# EAGLE design IronDriverRevA (EAGLE 6.2)

## Sheet 1 of 3
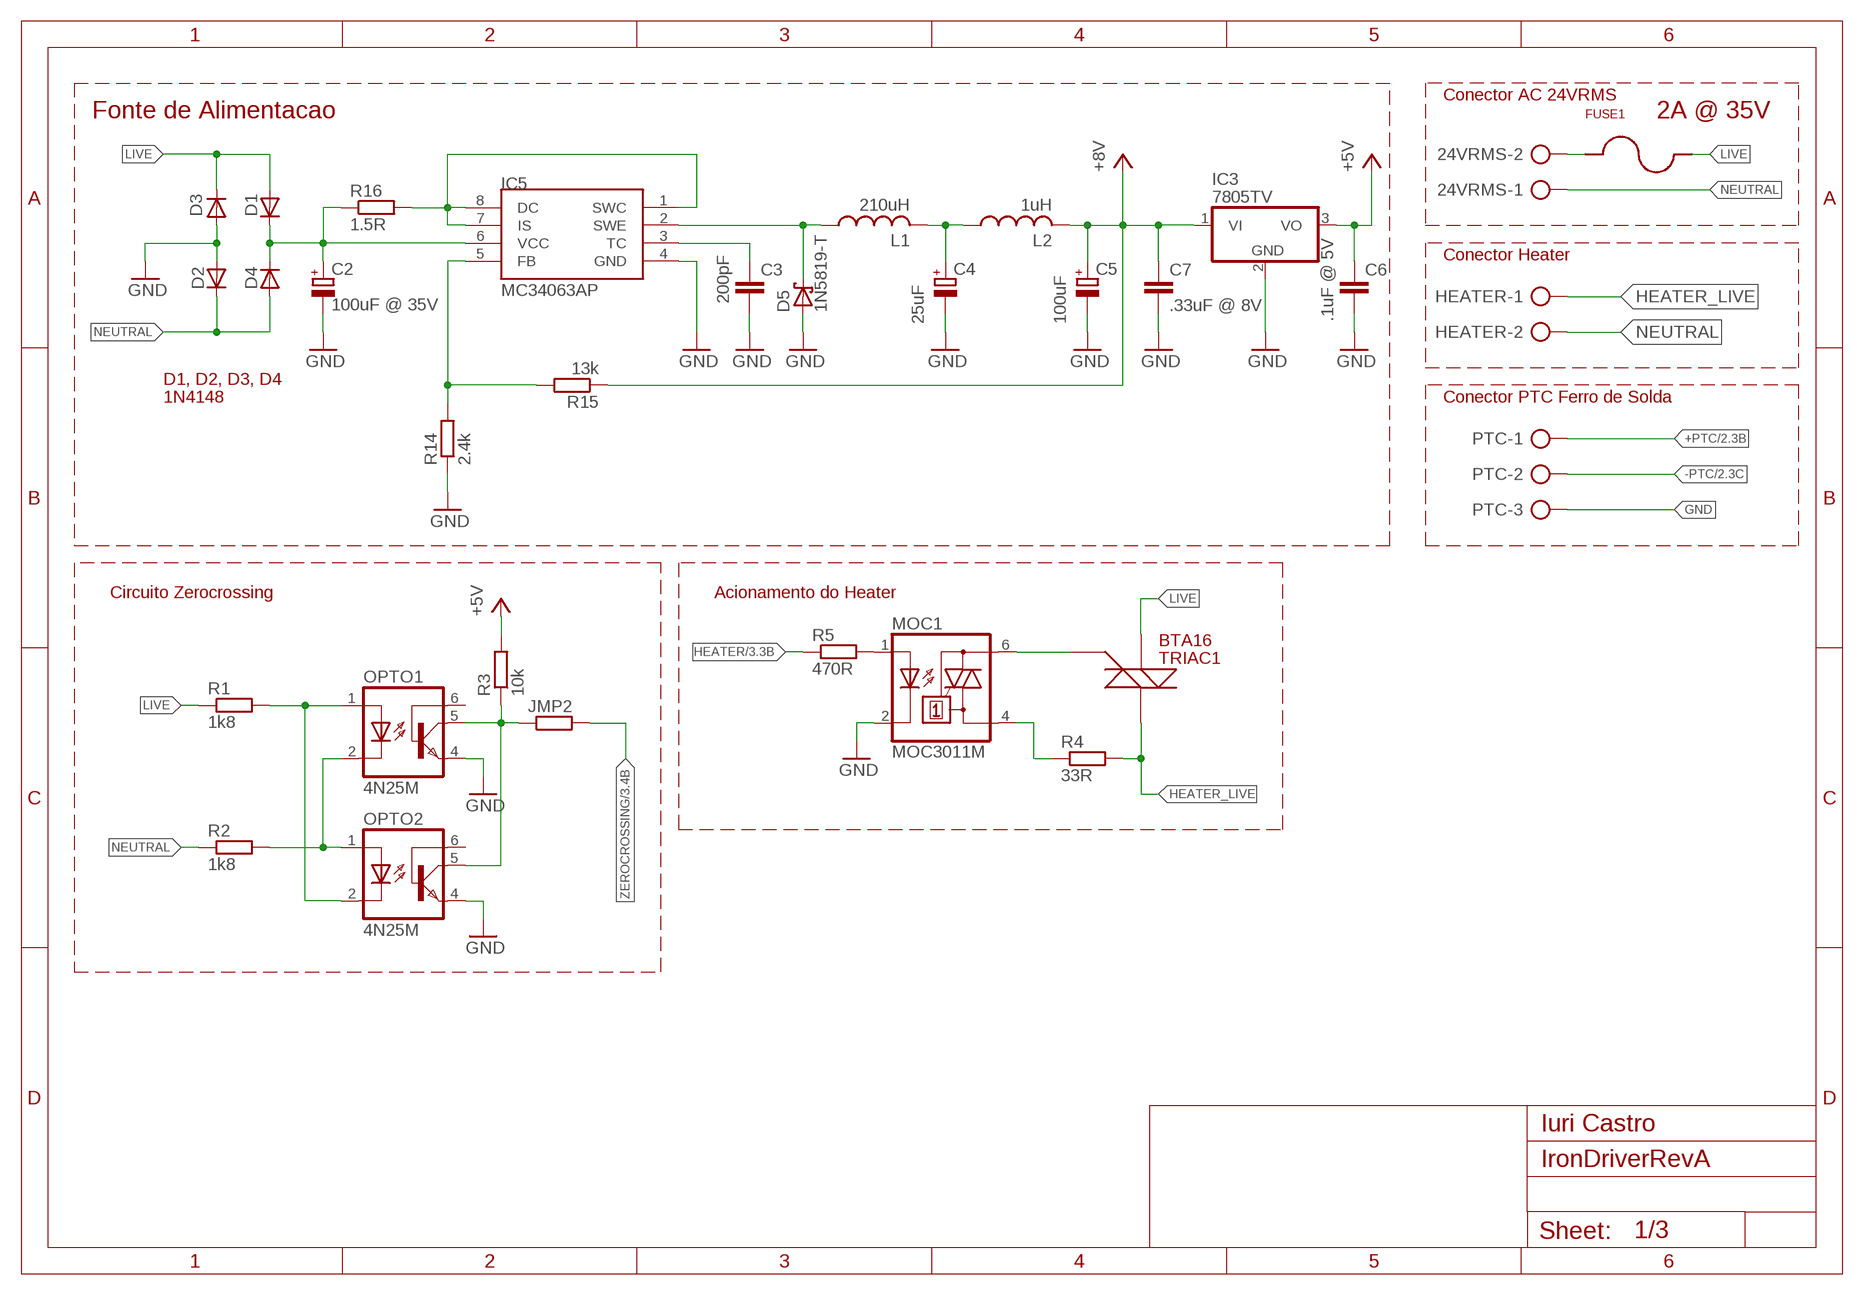
[diagram p0: schematic, sheet 1]

### Parts
24VRMS  AK500/2  [AK500/2]
C2  100uF @ 35V  CPOL-EUE3.5-8  [E3,5-8]
C3  200pF  C-EU025-025X050  [C025-025X050]
C4  25uF  CPOL-EUE3.5-8  [E3,5-8]
C5  100uF  CPOL-EUE3.5-8  [E3,5-8]
C6  .1uF @ 5V  C-EU025-025X050  [C025-025X050]
C7  .33uF @ 8V  C-EU025-025X050  [C025-025X050]
D1  1N4004  [DO41-10]
D2  1N4004  [DO41-10]
D3  1N4004  [DO41-10]
D4  1N4004  [DO41-10]
D5  1N5819-T  [DO41-7.6]
FUSE1  FUSEHOLDER  [FUSE32V2A5]
HEATER  AK500/2  [AK500/2]
IC3  7805TV  [TO220V]
IC5  MC34063AP  [DIL08]
JMP2  R-EU_R1206  [R1206]
L1  210uH  L-US6000-XXX-RC  [6000-XXXX-RC]
L2  1uH  L-US0204/7  [0204/7]
MOC1  MOC3011M  [DIL06]
OPTO1  4N25M  [DIL06]
OPTO2  4N25M  [DIL06]
PTC  AK500/3  [AK500/3]
R1  1k8  R-EU_0207/7  [0207/7]
R2  1k8  R-EU_0207/7  [0207/7]
R3  10k  R-EU_0207/7  [0207/7]
R4  33R  R-EU_0207/7  [0207/7]
R5  470R  R-EU_0207/7  [0207/7]
R14  2.4k  R-EU_0207/7  [0207/7]
R15  13k  R-EU_0207/7  [0207/7]
R16  1.5R  R-EU_0207/7  [0207/7]
TRIAC1  BTA16  BTA16-600BRG  [TO220V]

### Nets
+5V: C6.1 IC3.3(VO) R3.2 ; also sheet 3
+8V: C5.+ C7.1 IC3.1(VI) L2.2 R15.1 ; also sheet 2
+PTC: PTC.1 ; also sheet 2
-PTC: PTC.2 ; also sheet 2
GND: C2.- C3.2 C4.- C5.- C6.2 C7.2 D2.A D3.A D5.A IC3.2(GND) IC5.4(GND) MOC1.2(C) OPTO1.4(EMI) OPTO2.4(EMI) PTC.3 R14.1 ; also sheet 2,3
HEATER: R5.1 ; also sheet 3
HEATER_LIVE: HEATER.1 R4.2 TRIAC1.2(A2)
LIVE: D1.A D3.C FUSE1.P$3 FUSE1.P$4 R1.1 TRIAC1.1(A1)
N$1: MOC1.1(A) R5.2
N$3: OPTO1.2(C) OPTO2.1(A) R2.2
N$4: OPTO1.1(A) OPTO2.2(C) R1.2
N$8: MOC1.6(A2) TRIAC1.3(G)
N$10: MOC1.4(A1) R4.1
N$11: 24VRMS.2 FUSE1.P$1 FUSE1.P$2
N$13: D5.C IC5.2(SWE) L1.1
N$14: IC5.5(FB) R14.2 R15.2
N$15: IC5.1(SWC) IC5.7(IS) IC5.8(DC) R16.2
N$16: C4.+ L1.2 L2.1
N$18: C3.1 IC5.3(TC)
N$20: C2.+ D1.C D4.C IC5.6(VCC) R16.1
NEUTRAL: 24VRMS.1 D2.C D4.A HEATER.2 R2.1
ZEROCROSSING: JMP2.2 ; also sheet 3
ZEROCROSSING_B: JMP2.1 OPTO1.5(COL) OPTO2.5(COL) R3.1
Unconnected: OPTO1.6(BAS) OPTO2.6(BAS)

### Notes on the sheet
- Conector AC 24VRMS
- Fonte de Alimentacao | 2A @ 35V
- Conector Heater
- D1, D2, D3, D4
- 1N4148 | Conector PTC Ferro de Solda
- Circuito Zerocrossing | Acionamento do Heater
- Iuri Castro

## Sheet 2 of 3
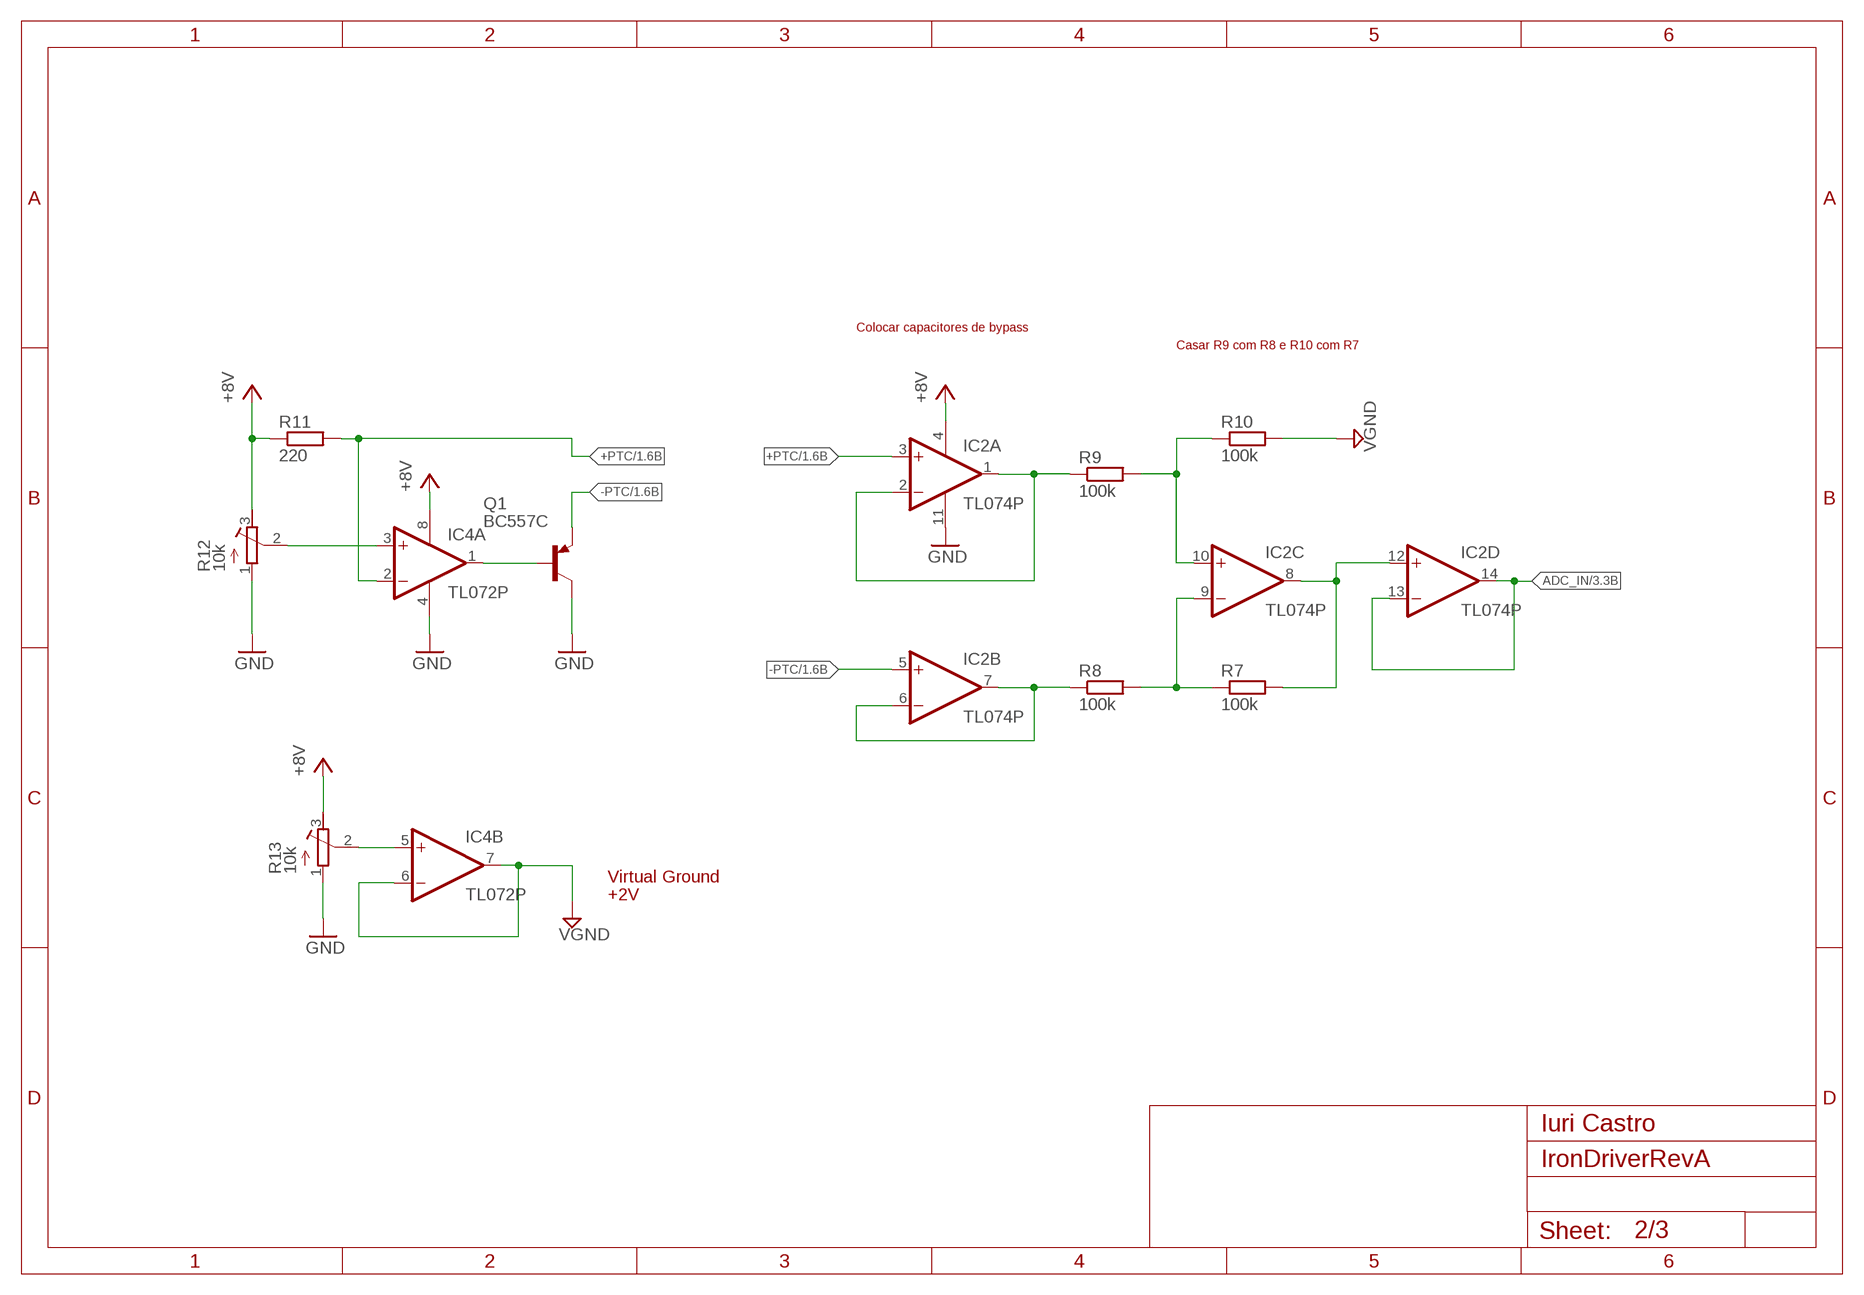
[diagram p1: schematic, sheet 2]

### Parts
IC2  TL074P  [DIL14]
IC4  TL072P  [DIL08]
Q1  BC557C  [TO92-EBC]
R7  100k  R-EU_0207/7  [0207/7]
R8  100k  R-EU_0207/7  [0207/7]
R9  100k  R-EU_0207/7  [0207/7]
R10  100k  R-EU_0207/7  [0207/7]
R11  220  R-EU_0207/7  [0207/7]
R12  10k  R-TRIMM3296W  [RTRIM3296W]
R13  10k  R-TRIMM3296W  [RTRIM3296W]

### Nets
+8V: IC2.4(P:V+) IC4.8(P:V+) R11.1 R12.3(E) R13.3(E) ; also sheet 1
+PTC: IC2.3(A:+IN) IC4.2(A:-IN) R11.2 ; also sheet 1
-PTC: IC2.5(B:+IN) Q1.E ; also sheet 1
ADC_IN: IC2.13(D:-IN) IC2.14(D:OUT) ; also sheet 3
GND: IC2.11(P:V-) IC4.4(P:V-) Q1.C R12.1(A) R13.1(A) ; also sheet 1,3
N$2: IC4.1(A:OUT) Q1.B
N$5: IC2.9(C:-IN) R7.1 R8.2
N$6: IC2.10(C:+IN) R9.2 R10.1
N$7: IC4.5(B:+IN) R13.2(S)
N$9: IC2.1(A:OUT) IC2.2(A:-IN) R9.1
N$12: IC2.6(B:-IN) IC2.7(B:OUT) R8.1
N$19: IC2.8(C:OUT) IC2.12(D:+IN) R7.2
N$21: IC4.3(A:+IN) R12.2(S)
VGND: IC4.6(B:-IN) IC4.7(B:OUT) R10.2 ; also sheet 3

### Notes on the sheet
- Colocar capacitores de bypass
- Casar R9 com R8 e R10 com R7
- Virtual Ground
- +2V
- Iuri Castro

## Sheet 3 of 3
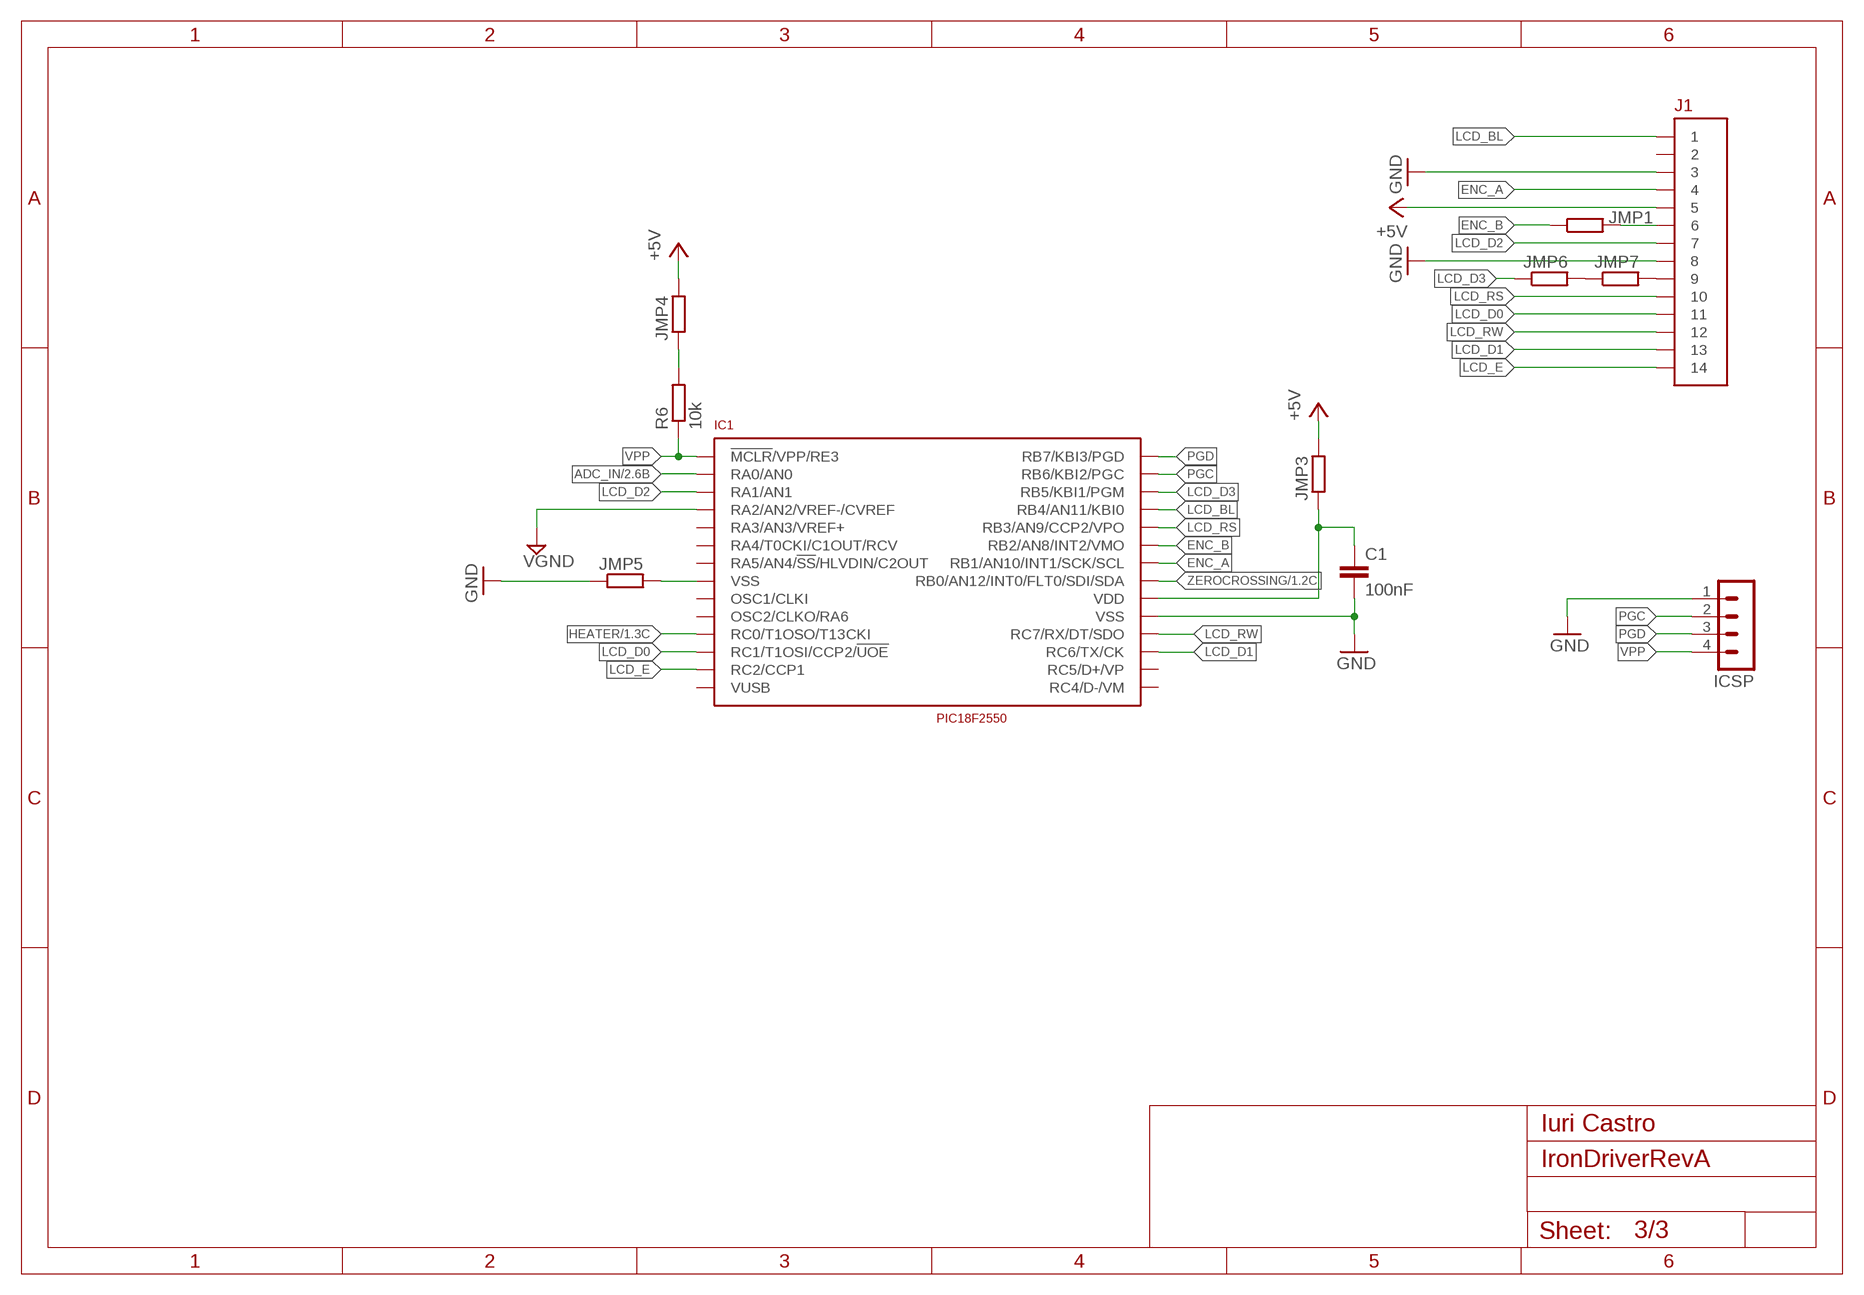
[diagram p2: schematic, sheet 3]

### Parts
C1  100nF  C-EUC0805  [C0805]
IC1  PIC18F2550  [DIL28-3]
ICSP  MA04-1  [MA04-1]
J1  FFC14X1  [FFC14X1]
JMP1  R-EU_R1206  [R1206]
JMP3  R-EU_R1206  [R1206]
JMP4  R-EU_R1206  [R1206]
JMP5  R-EU_R1206  [R1206]
JMP6  R-EU_R1206  [R1206]
JMP7  R-EU_R1206  [R1206]
R6  10k  R-EU_0207/7  [0207/7]

### Nets
+5V: JMP3.2 JMP4.2 ; also sheet 1
+5V_JMP4: J1.P$5 JMP4.1 R6.2 ; supply symbol labelled +5V
+5V_MC: C1.1 IC1.20(VDD) JMP3.1
ADC_IN: IC1.2(RA0/AN0) ; also sheet 2
ENC_A: IC1.22(RB1/AN10/INT1/SCK/SCL) J1.P$4
ENC_B: IC1.23(RB2/AN8/INT2/VMO) JMP1.1
GND: C1.2 IC1.8(VSS) IC1.19(VSS) ICSP.1 J1.P$8 JMP5.2 ; also sheet 1,2
GND_JMP5: J1.P$3 JMP5.1 ; supply symbol labelled GND
HEATER: IC1.11(RC0/T1OSO/T13CKI) ; also sheet 1
LCD_BL: IC1.25(RB4/AN11/KBI0) J1.P$1
LCD_D0: IC1.12(RC1/T1OSI/CCP2/!UOE) J1.P$11
LCD_D1: IC1.17(RC6/TX/CK) J1.P$13
LCD_D2: IC1.3(RA1/AN1) J1.P$7
LCD_D3: IC1.26(RB5/KBI1/PGM) JMP6.1
LCD_E: IC1.13(RC2/CCP1) J1.P$14
LCD_RS: IC1.24(RB3/AN9/CCP2/VPO) J1.P$10
LCD_RW: IC1.18(RC7/RX/DT/SDO) J1.P$12
N$17: J1.P$6 JMP1.2
N$23: J1.P$9 JMP7.2
N$24: JMP6.2 JMP7.1
PGC: IC1.27(RB6/KBI2/PGC) ICSP.2
PGD: IC1.28(RB7/KBI3/PGD) ICSP.3
VGND: IC1.4(RA2/AN2/VREF-/CVREF) ; also sheet 2
VPP: IC1.1(!MCLR!/VPP/RE3) ICSP.4 R6.1
ZEROCROSSING: IC1.21(RB0/AN12/INT0/FLT0/SDI/SDA) ; also sheet 1
Unconnected: IC1.5(RA3/AN3/VREF+) IC1.6(RA4/T0CKI/C1OUT/RCV) IC1.7(RA5/AN4/!SS!/HLVDIN/C2OUT) IC1.9(OSC1/CLKI) IC1.10(OSC2/CLKO/RA6) IC1.14(VUSB) IC1.15(RC4/D-/VM) IC1.16(RC5/D+/VP) J1.P$2

### Notes on the sheet
- Iuri Castro

## Library data of the parts
24VRMS HEATER = con-ptr500:AK500/2: CONNECTOR; OC_FARNELL: unknown; OC_NEWARK: unknown
C1 C3 C6 C7 = rcl:C-EU: CAPACITOR, European symbol
C2 C4 C5 = rcl:CPOL-EU: POLARIZED CAPACITOR, European symbol
D1-D4 = diode:1N4004: DIODE general purpose rectifier, 1 A
D5 = diode:1N581*: 1.0A SCHOTTKY BARRIER RECTIFIER Source: http://www.diodes.com/datasheets/ds23001.pdf
FUSE1 = FUSEHOLDER:FUSEHOLDER: Fuse Holder
IC1 = PIC18F2550:PIC18F2550: PIC18F2550 Dip
IC2 = linear:TL074: OP AMP
IC3 = linear:78*: Positive VOLTAGE REGULATOR Source: http://cache.national.com/ds/LM/LM78L05.pdf http://www.fairchildsemi.com/ds/LM/LM7805.pdf
IC4 = linear:TL072: OP AMP
IC5 = mc34063:MC34063
ICSP = con-lstb:MA04-1: PIN HEADER; OC_FARNELL: unknown; OC_NEWARK: unknown
J1 = FFC:FFC14X1: Conector FFC 14
JMP1-JMP7 R1-R11 R14-R16 = rcl:R-EU_: RESISTOR, European symbol
L1 L2 = rcl:L-US: INDUCTOR, American symbol
MOC1 = optocoupler:MOC30*M: RANDOM-PHASE OPTOISOLATORS TRIAC DRIVER OUTPUT Source: http://www.fairchildsemi.com MOC3020-M.pdf; MF: FAIRCHILD SEMICONDUCTOR; MPN: MOC3011-M; OC_FARNELL: 1021363; OC_NEWARK: 72K8893
OPTO1 OPTO2 = optocoupler:4N*?M: General Purpose 6-Pin Phototransistor Optocouplers Source: http://www.fairchildsemi.com/ds/4N/4N35-M.pdf; MPN: 4N25-M; OC_FARNELL: 1021349; OC_NEWARK: 98K9084
PTC = con-ptr500:AK500/3: CONNECTOR; OC_FARNELL: unknown; OC_NEWARK: unknown
Q1 = transistor-pnp:BC557*: PNP Transistror
R12 R13 = rcl:R-TRIMM: Trimm resistor
TRIAC1 = BTA16-600BRG:BTA16-600BRG: BTA16-600BRG

## Board
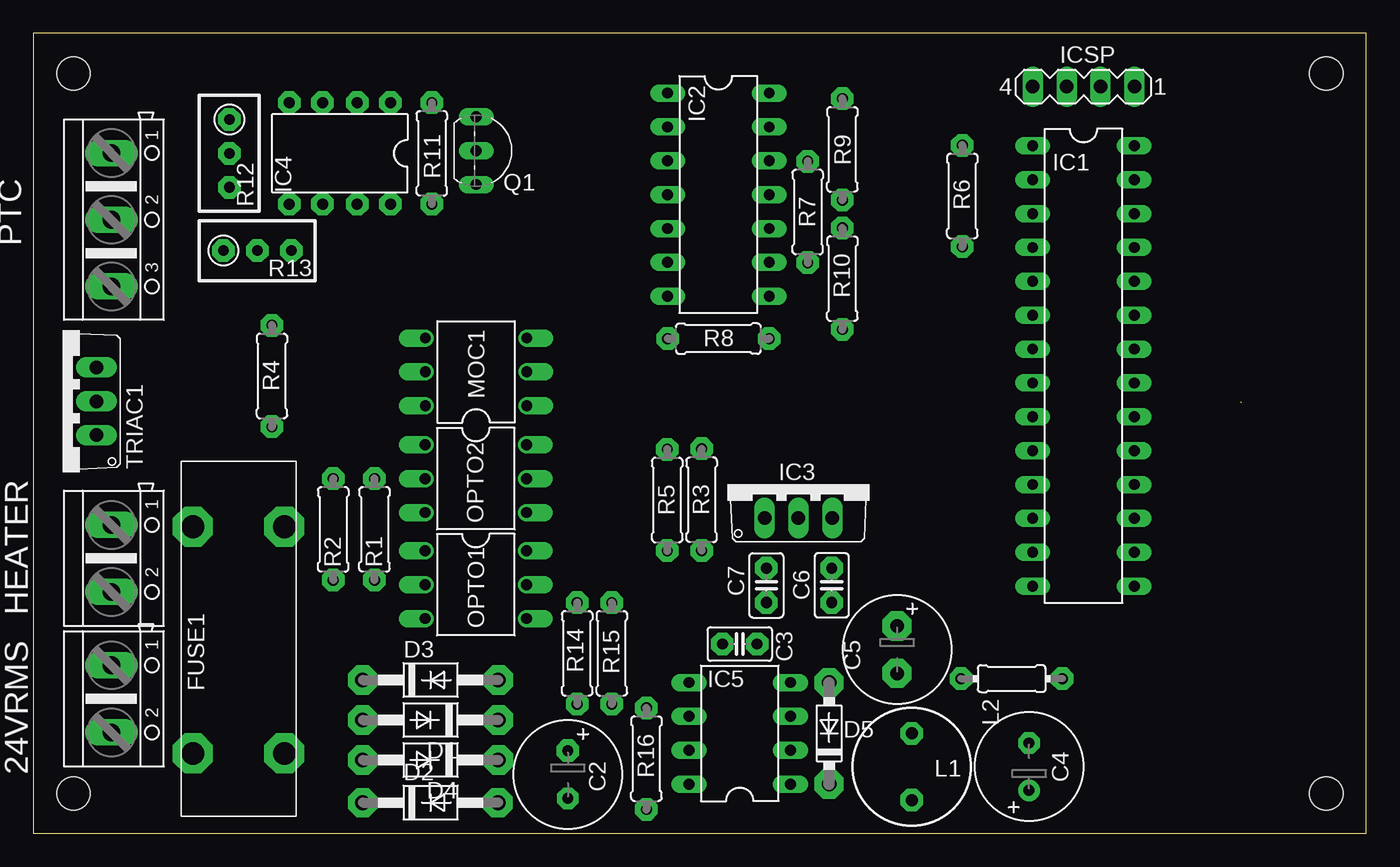
[diagram p3: board, top side]
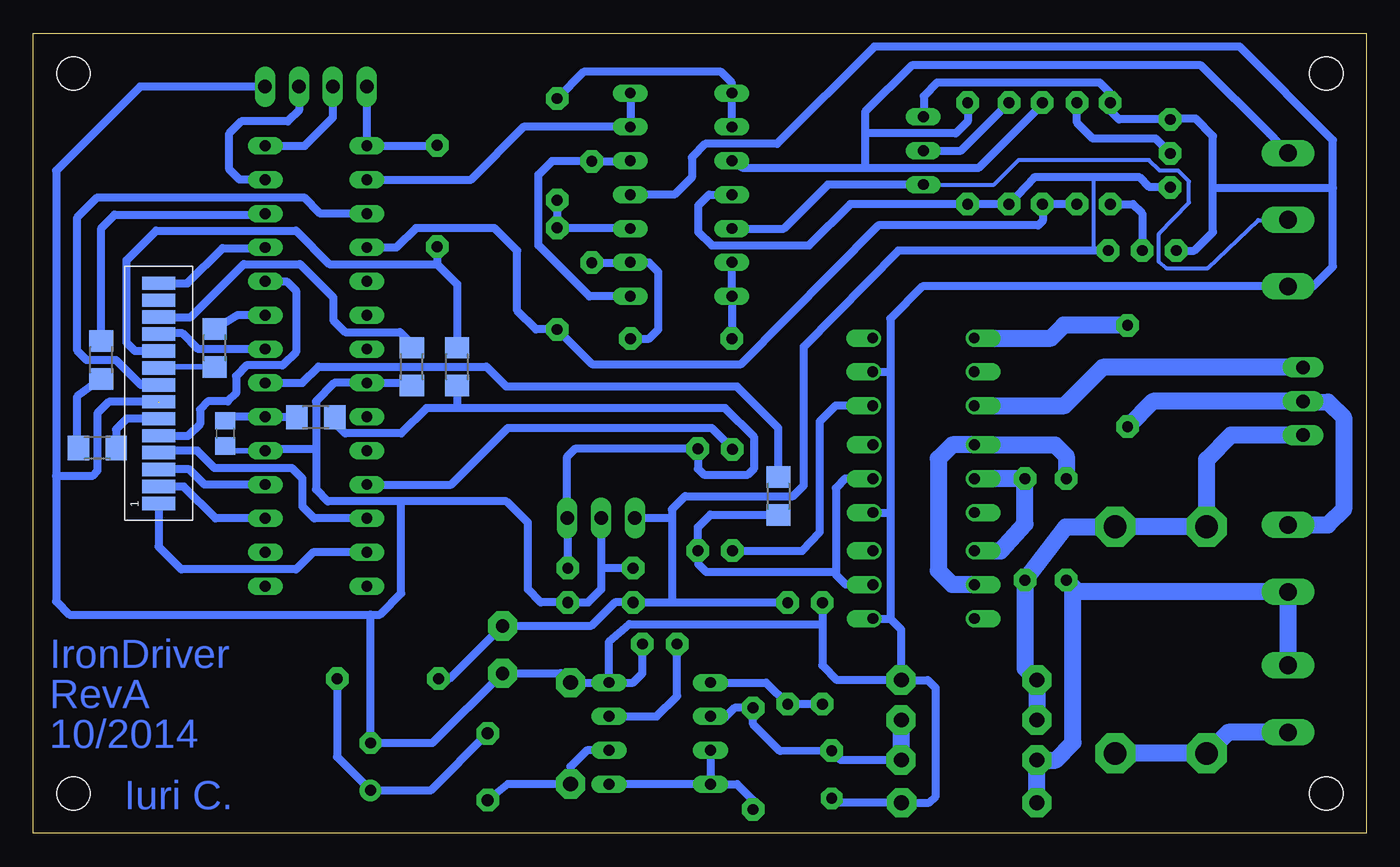
[diagram p4: board, bottom side, seen from below]

Size 100 x 60 mm. Coordinates in mm from the lower left corner, seen from the top.
Outline: 0,0 100,0 100,60 0,60 0,0
Copper layers (1*16): Top 0.035mm / dielectric 1.5mm / Bottom 0.035mm
Design rules: minimum track width 10mil, minimum drill 24mil, track to track 8mil, track to pad 8mil, pad to pad 8mil, via to via 8mil, smd to smd 8mil, copper to edge 40mil, drill to drill 8mil, minimum pad ring 10mil, minimum via ring 8mil, stop-mask expansion 4mil, vias tented up to drill 0mil, thermal gap 10mil
Holes 2.5 mm at 3,3 3,57 97,57 97,3

### Footprints (pad centres in the part's own frame; a part is rotated, then mirrored left to right if it is on the bottom)
AK500/2 = drill 1.321 long: 1 -2.515,0; 2 2.515,0
C0805 = smd 1.3 x 1.5: 1 -0.95,0; 2 0.95,0
E3,5-8 = drill 0.813 pad 1.6: + -1.778,0 | drill 0.813 pad 1.6 octagon: - 1.778,0
C025-025X050 = drill 0.813 octagon: 1 -1.27,0; 2 1.27,0
DO41-10 = drill 1.118: A 5.08,0; C -5.08,0
DO41-7.6 = drill 1.1 pad 1.7: A 3.81,0; C -3.81,0
FUSE32V2A5 = drill 1.7 pad 3 octagon: P$1 -8.5,3.43; P$2 -8.5,-3.43; P$3 8.5,3.43; P$4 8.5,-3.43
DIL28-3 = drill 0.813 long: 1 -16.51,-3.81; 2 -13.97,-3.81; 3 -11.43,-3.81; 4 -8.89,-3.81; 5 -6.35,-3.81; 6 -3.81,-3.81; 7 -1.27,-3.81; 8 1.27,-3.81; 9 3.81,-3.81; 10 6.35,-3.81; 11 8.89,-3.81; 12 11.43,-3.81; 13 13.97,-3.81; 14 16.51,-3.81; 15 16.51,3.81; 16 13.97,3.81; 17 11.43,3.81; 18 8.89,3.81; 19 6.35,3.81; 20 3.81,3.81; 21 1.27,3.81; 22 -1.27,3.81; 23 -3.81,3.81; 24 -6.35,3.81; 25 -8.89,3.81; 26 -11.43,3.81; 27 -13.97,3.81; 28 -16.51,3.81
DIL14 = drill 0.813 long: 1 -7.62,-3.81; 2 -5.08,-3.81; 3 -2.54,-3.81; 4 0,-3.81; 5 2.54,-3.81; 6 5.08,-3.81; 7 7.62,-3.81; 8 7.62,3.81; 9 5.08,3.81; 10 2.54,3.81; 11 0,3.81; 12 -2.54,3.81; 13 -5.08,3.81; 14 -7.62,3.81
TO220V = drill 1.016 long: 1 -2.54,-2.54; 2 0,-2.54; 3 2.54,-2.54
DIL08 = drill 0.813 pad 1.27: 1 -3.81,-3.81; 2 -1.27,-3.81; 3 1.27,-3.81; 4 3.81,-3.81; 5 3.81,3.81; 6 1.27,3.81; 7 -1.27,3.81; 8 -3.81,3.81
DIL08' = drill 0.813 long: 1 -3.81,-3.81; 2 -1.27,-3.81; 3 1.27,-3.81; 4 3.81,-3.81; 5 3.81,3.81; 6 1.27,3.81; 7 -1.27,3.81; 8 -3.81,3.81
MA04-1 = drill 1.016 long: 1 -3.81,0; 2 -1.27,0; 3 1.27,0; 4 3.81,0
FFC14X1 = smd 1 x 2.5: P$1 -8.255,0; P$2 -6.985,0; P$3 -5.715,0; P$4 -4.445,0; P$5 -3.175,0; P$6 -1.905,0; P$7 -0.635,0; P$8 0.635,0; P$9 1.905,0; P$10 3.175,0; P$11 4.445,0; P$12 5.715,0; P$13 6.985,0; P$14 8.255,0
R1206 = smd 1.6 x 1.803: 1 -1.422,0; 2 1.422,0
6000-XXXX-RC = drill 0.9 pad 1.422: 1 -2.5,0; 2 2.5,0
0204/7 = drill 0.813 octagon: 1 -3.81,0; 2 3.81,0
DIL06 = drill 0.813 offset: 1 -2.54,-3.81; 2 0,-3.81; 3 2.54,-3.81; 4 2.54,3.81; 5 0,3.81; 6 -2.54,3.81
AK500/3 = drill 1.321 long: 1 -5.004,0; 2 0,0; 3 5.004,0
TO92-EBC = drill 0.813 long: B 0,-1.27; C -2.54,-1.27; E 2.54,-1.27
0207/7 = drill 0.813 octagon: 1 -3.81,0; 2 3.81,0
RTRIM3296W = drill 0.61: 1 0,-2.54; 2 0,0; 3 0,2.54

### Placement (x,y rotation side)
24VRMS  5.85,10.09 270 top
C1  85.6,30 270 bottom
C2  40.1,4.4 270 top
C3  53,14.2 0 top
C4  74.7,5 90 top
C5  64.8,13.8 270 top
C6  59.9,18.6 270 top
C7  55,18.6 90 top
D1  29.8,8.5 180 top
D2  29.8,2.3 0 top
D3  29.8,11.5 0 top
D4  29.8,5.5 180 top
D5  59.7,7.5 90 top
FUSE1  15.4,14.5 90 top
HEATER  5.85,20.62 270 top
IC1  78.79,35.05 270 top
IC2  51.4,47.9 270 top
IC3  57.4,26.2 0 top
IC4  23,51 180 top
IC5  MC34063AP  [DIL08']  53,7.5 90 top
ICSP  78.8,56 180 top
J1  90.6,33 270 bottom
JMP1  86.4,36.4 270 bottom
JMP2  44.1,25.3 90 bottom
JMP3  78.8,31.2 0 bottom
JMP4  68.2,35 270 bottom
JMP5  71.6,35 270 bottom
JMP6  94.9,35.5 270 bottom
JMP7  95.2,28.9 0 bottom
L1  65.9,5 90 top
L2  73.4,11.6 180 top
MOC1  33.22,34.61 90 top
OPTO1  33.2,18.65 270 top
OPTO2  33.2,26.6 270 top
PTC  5.85,46.02 270 top
Q1  34.5,51.2 270 top
R1  25.6,22.8 90 top
R2  22.5,22.8 90 top
R3  50.14,25.02 90 top
R4  17.9,34.3 270 top
R5  47.56,25 270 top
R6  69.7,47.8 270 top
R7  58.1,46.6 90 top
R8  51.4,37.1 0 top
R9  60.7,51.3 270 top
R10  60.7,41.6 270 top
R11  29.9,51 90 top
R12  14.7,51 180 top
R13  16.8,43.7 270 top
R14  40.8,13.5 270 top
R15  43.4,13.5 270 top
R16  46,5.6 270 top
TRIAC1  2.2,32.4 90 top

### Tracks (layer width: path | path; a pad name or v marks a point on that pad's centre or on a via)
+5V  (via drill 0.8 pad 1.68)
  Bottom 0.406: 59.9,23.62 IC3.3 | JMP3.2 77.38,30.78
  Bottom 0.61: C6.1 v59.9,19.9 59.9,23.62 | 77.38,30.78 76.6,30 72.4,30 70.5,31.9 68.2,31.9 | 68.2,31.9 48.1,31.9 45.9,29.7 45.9,27.4 46.4,26.9 49.7,26.9 50.14,27.34 R3.2 59.37,28.83 59.94,28.26 IC3.3 | JMP4.2 68.2,31.9
+5V_JMP4
  Bottom 0.61: 69.7,42.7 77.8,42.7 80.3,45.2 90.8,45.2 93,43 93,36.8 92.38,36.17 J1.P$5 | 69.7,42.7 68.2,41.2 JMP4.1 | R6.2 69.7,42.7
+5V_MC
  Bottom 0.406: 85.31,31.24 C1.1 | 82.56,31.2 IC1.20
  Bottom 0.61: IC1.20 85.31,31.24 | JMP3.1 82.56,31.2
+8V  (via drill 0.8 pad 1.68)
  Bottom 0.305: 20.45,43.7 20.45,49.2
  Bottom 0.406: 52.1,17.41 52.2,17.31 | 54.98,17.31 C7.1 | 52.16,23.66 52.1,23.6
  Bottom 0.61: R13.3 v19.35,43.7 20.45,43.7 35.1,43.7 42.2,36.5 42.2,26.1 43,25.3 51.1,25.3 52.1,24.3 52.1,23.6 52.1,17.41 | IC2.4 49.3,47.9 50.1,47.1 50.1,45.1 49.09,44.09 41.8,44.09 38.7,47.19 R11.1 IC4.8 24.94,49.16 24.9,49.2 20.45,49.2 17,49.2 16.26,48.46 R12.3 | R15.1 52.2,17.31 54.98,17.31 | C7.1 56.37,17.33 58.12,15.58 C5.+ 68.78,11.6 L2.2 | IC3.1 52.16,23.66
+PTC  (via drill 0.8 pad 1.68)
  Bottom 0.61: PTC.1 7.25,52.45 12.4,57.6 34.1,57.6 37.6,54.1 37.6,52.5 | R11.2 v29.9,54.8 29.9,53.4 30.8,52.5 37.6,52.5 | 37.6,49.9 29.1,49.9 24.27,54.73 IC4.2 | 37.6,52.5 37.6,49.9 | 37.6,49.9 46.75,49.9 IC2.3
-PTC
  Bottom 0.305: 5.77,46 8.1,46 11.9,42.4 15,42.4 15.55,42.85 15.55,44.95 13.3,47.3 13.3,48.9 14.1,49.7 15.5,49.7 16.3,50.5 26.09,50.5 27.93,48.66 Q1.E
  Bottom 0.406: 5.77,46 PTC.2
  Bottom 0.61: IC2.5 43.7,45.36 40.4,48.66 Q1.E
ADC_IN
  Bottom 0.406: 74.96,49 IC1.2
  Bottom 0.61: IC2.14 IC2.13 63.22,52.98 67.2,49 74.96,49
ENC_A
  Bottom 0.406: 90.55,37.5 J1.P$4
  Bottom 0.61: IC1.22 87.62,36.32 88.8,37.5 90.55,37.5
ENC_B
  Bottom 0.61: IC1.23 84.66,38.86 JMP1.1
GND  (via drill 0.8 pad 1.68, 1 pad 2.18)  (1 unrouted)
  Bottom 0.406: 90.7,32.4 90.6,32.3 | C1.2 85.25,28.7 IC1.19 82.5,28.8 | v19.2,54.8 IC4.4 | 54.3,14.17 C3.2 | IC5.4 | 14.64,53.6 R12.1 | 71.7,33.78 JMP5.2 | 35.74,24.06 35.7,24.1 | 35.71,34.61 35.7,34.6 | 57.33,19.87 57.4,19.8 | 33.2,53.77 Q1.C
  Bottom 0.61: R12.1 18.54,53.54 19.2,54.2 v19.2,54.8 | 72.4,24.9 64.5,24.9 62.9,23.3 62.9,18.3 61.93,17.33 C6.2 58.37,17.33 57.4,18.3 57.4,19.8 IC3.2 | 72.4,24.9 77.9,24.9 78.8,25.8 78.8,28.8 | 78.8,28.8 82.5,28.8 | IC4.4 19.21,55.51 20,56.3 32.2,56.3 33.2,55.3 33.2,53.77 | IC2.11 51.9,47.9 50.6,49.2 50.6,50.7 49.6,51.7 44.2,51.7 36.9,59 9.5,59 2.5,52 2.5,48.4 | 54.3,14.17 54.3,12 54.99,11.31 IC5.4 D5.A 60.41,12.02 C5.- 70.04,6.78 C4.- 74.7,16.4 | IC5.4 56.8,14.4 55.3,15.7 40.8,15.7 | R14.1 v40.8,17.3 40.8,15.7 | 2.5,48.4 2.5,42.5 3.98,41.02 PTC.3 33.28,41.02 35.7,38.6 35.7,34.6 35.7,24.1 35.7,16.1 | R13.1 v14.25,43.7 12.9,43.7 11.5,45.1 11.5,48.4 | 11.5,48.4 11.5,52.3 12.8,53.6 14.64,53.6 | 2.5,48.4 11.5,48.4 | OPTO1.4 36.71,16.11 35.7,16.1 | J1.P$8 94.33,32.37 95.2,31.5 95.2,27.2 95.6,26.8 98.3,26.8 | 74.7,16.4 97.3,16.4 98.3,17.4 98.3,26.8 | 74.7,16.4 74,16.4 72.4,18 72.4,24.9 | 78.8,28.8 78.8,32.4 77.42,33.78 IC1.8 71.7,33.78 | ICSP.1 92,56 98.3,49.7 98.3,26.8 | OPTO2.4 35.74,24.06 | MOC1.2 35.71,34.61 | C7.2 57.33,19.87 | C2.- 39.78,2.3 D2.A v34.85,2.3 32.8,2.3 32.3,2.8 32.3,10.9 32.9,11.5 D3.A | D3.A 34.88,15.28 35.7,16.1 | 40.8,15.7 40.8,12.6 39.7,11.5 v34.9,11.5 D3.A
GND_JMP5
  Bottom 0.406: 90.58,38.7 J1.P$3
  Bottom 0.61: JMP5.1 71.62,36.72 72.5,37.6 76.6,37.6 77.5,38.5 77.5,40.2 80,42.7 84.2,42.7 88.19,38.72 J1.P$3
HEATER
  Bottom 0.406: R5.1 47.91,29.21
  Bottom 0.61: IC1.11 68.64,26.16 64.4,30.4 49.1,30.4 47.91,29.21
HEATER_LIVE
  Bottom 1.27: HEATER.1 2.87,23.14 1.7,24.3 1.7,31.2 2.85,32.35 TRIAC1.2 15.99,32.4 R4.2
LCD_BL
  Bottom 0.406: 82.64,43.9 IC1.25
  Bottom 0.61: J1.P$1 88.44,41.26 85.8,43.9 82.64,43.9
LCD_D0
  Bottom 0.406: 90.45,28.7 J1.P$11
  Bottom 0.61: 90.45,28.7 87.7,28.7 86.4,27.4 80.6,27.4 79.8,26.6 79.8,24.5 78.92,23.62 IC1.12
LCD_D1
  Bottom 0.406: 90.58,26 J1.P$13
  Bottom 0.61: IC1.17 86.32,23.62 88.7,26 90.58,26
LCD_D2
  Bottom 0.61: J1.P$7 91.94,33.63 93.8,35.5 96,35.5 96.7,36.2 96.7,46.2 95.2,47.7 79.7,47.7 78.48,46.48 IC1.3
LCD_D3
  Bottom 0.406: 82.68,46.4 IC1.26
  Bottom 0.61: 82.68,46.4 93.9,46.4 94.9,45.4 JMP6.1
LCD_E
  Bottom 0.406: 90.55,24.8 J1.P$14
  Bottom 0.61: IC1.13 79.02,21.08 80.3,19.8 88.9,19.8 90.6,21.5 J1.P$14
LCD_RS
  Bottom 0.406: 90.58,29.8 J1.P$10
  Bottom 0.61: IC1.24 81,41.4 80.3,40.7 80.3,36.1 81.3,35.1 84,35.1 84.8,34.3 84.8,33 85.4,32.4 86.9,32.4 87.5,31.8 87.5,30.7 88.4,29.8 90.58,29.8
LCD_RW
  Bottom 0.406: 90.58,27.3 J1.P$12
  Bottom 0.61: IC1.18 87.16,26.16 88.3,27.3 90.58,27.3
LIVE
  Bottom 1.27: TRIAC1.1 10.14,29.86 11.97,28.03 FUSE1.P$3 FUSE1.P$4 22.54,22.99 R1.1 25.6,12.38 D3.C D1.A
N$1
  Bottom 0.61: 47.53,21.16 R5.2 42.31,21.19 41,22.6 41,30.9 39.8,32.1 37.36,32.1 MOC1.1
N$2  (via drill 0.8 pad 1.68)
  Bottom 0.406: v26.8,54.8 IC4.1
  Bottom 0.61: Q1.B 30.4,51.2 v26.8,54.8
N$3
  Bottom 1.27: R2.2 22.5,28.3 23.34,29.14 OPTO2.1 31.06,29.14 32.1,28.1 32.1,19.7 31.05,18.65 OPTO1.2
N$4  (via drill 0.8 pad 1.68)
  Bottom 1.27: OPTO2.2 28.58,26.61 R1.2 v25.6,26.6 25.6,23.2 27.41,21.19 OPTO1.1
N$5  (via drill 0.8 pad 1.68)
  Bottom 0.406: 55.19,42.8 IC2.9 55.24,42.79
  Bottom 0.61: R8.2 v55.2,37.1 53.8,37.1 53.1,37.8 53.1,42.1 53.8,42.8 55.19,42.8 | R7.1 55.24,42.79
N$6
  Bottom 0.406: 55.26,45.41 IC2.10
  Bottom 0.61: 55.26,45.41 R10.1 R9.2
N$7
  Bottom 0.61: R13.2 16.8,46.5 17.49,47.19 IC4.5
N$8
  Bottom 1.27: TRIAC1.3 19.76,34.94 22.63,32.07 MOC1.6
N$9
  Bottom 0.61: IC2.2 IC2.1 47.59,56.29 48.4,57.1 58.71,57.1 R9.1
N$10
  Bottom 1.27: R4.1 22.69,38.11 23.65,37.15 MOC1.4
N$11
  Bottom 1.27: FUSE1.P$2 FUSE1.P$1 10.35,7.58 24VRMS.2
N$12
  Bottom 0.61: IC2.6 IC2.7 R8.1
N$13  (via drill 1 pad 2.18)
  Bottom 0.61: IC5.2 58.47,6.23 59.7,5 v59.7,3.7 D5.C 64.41,3.69 L1.1
N$14
  Bottom 0.61: R14.2 R15.2 45.02,11.31 IC5.5
N$15  (via drill 0.8 pad 1.68)
  Bottom 0.61: IC5.7 IC5.8 | IC5.8 IC5.1 | IC5.8 47.19,3.69 46,2.5 v46,1.8 R16.2
N$16
  Bottom 0.61: L1.2 70.2,3.2 74.68,3.2 C4.+ 77.21,5.73 L2.1
N$17
  Bottom 0.406: JMP1.2 90.53,34.98 J1.P$6
N$18
  Bottom 0.406: 51.7,14.17 C3.1
  Bottom 0.61: IC5.3 53.23,8.77 51.7,10.3 51.7,14.17
N$19
  Bottom 0.406: 55.24,50.41 IC2.12
  Bottom 0.61: IC2.8 58.28,40.28 62.1,44.1 62.1,49.4 61.09,50.41 R7.2 55.24,50.41
N$20  (via drill 0.8 pad 1.68, 1 pad 2.18)
  Bottom 0.61: IC5.6 49.12,8.7 48.1,8.7 47.39,9.41 R16.1 v46,9.4 46,8.2 43.97,6.17 C2.+ 39.42,5.5 v34.9,5.5 D4.C
  Bottom 1.27: D4.C D1.C
N$21
  Bottom 0.61: R12.2 15.8,52.1 20.5,52.1 21.7,53.3 21.7,54.78 IC4.3
N$22  (via drill 0.8 pad 1.68)
  other vias: 47.6,37.1
N$23
  Bottom 0.406: 93.8,28.92 JMP7.2
  Bottom 0.61: J1.P$9 93,31.09 93.8,30.3 93.8,28.92
N$24
  Bottom 0.406: 96.7,28.98 JMP7.1
  Bottom 0.61: 96.7,28.98 96.7,32.78 JMP6.2
N$25  (via drill 0.8 pad 1.68)
  other vias: 22.5,26.6
N$26  (via drill 0.8 pad 1.68)
  other vias: 47.55,28.8
N$27  (via drill 0.8 pad 1.68)
  other vias: 50.15,28.85
N$28  (via drill 0.8 pad 1.68)
  other vias: 47.55,21.2
N$29  (via drill 0.8 pad 1.68)
  other vias: 50.15,21.2
N$30  (via drill 0.8 pad 1.68)
  other vias: 17.9,38.1
N$31  (via drill 0.8 pad 1.68)
  other vias: 17.9,30.5
N$32  (via drill 0.8 pad 1.68)
  other vias: 60.7,55.1
N$33  (via drill 0.8 pad 1.68)
  other vias: 60.7,47.5
N$34  (via drill 0.8 pad 1.68)
  other vias: 60.7,45.4
N$35  (via drill 0.8 pad 1.68)
  other vias: 60.7,37.8
N$36  (via drill 0.8 pad 1.68)
  other vias: 58.1,42.8
N$37  (via drill 0.8 pad 1.68)
  other vias: 58.1,50.4
N$38  (via drill 0.8 pad 1.68)
  other vias: 69.7,51.6
N$39  (via drill 0.8 pad 1.68)
  other vias: 69.7,44
N$40  (via drill 0.8 pad 1.68)
  other vias: 51.7,14.2
N$41  (via drill 0.8 pad 1.68)
  other vias: 54.3,14.2
N$42  (via drill 0.8 pad 1.68)
  other vias: 55,17.3
N$43  (via drill 0.8 pad 1.68)
  other vias: 55,19.9
N$44  (via drill 0.8 pad 1.68)
  other vias: 59.9,17.3
N$45  (via drill 0.8 pad 1.68)
  other vias: 16.8,43.7
N$46  (via drill 0.8 pad 1.68)
  other vias: 69.6,11.6
N$47  (via drill 0.8 pad 1.68)
  other vias: 43.4,17.3
N$48  (via drill 0.8 pad 1.68)
  other vias: 40.8,9.7 40.1,6.2
N$49  (via drill 0.8 pad 1.68)
  other vias: 43.4,9.7
N$50  (via drill 0.8 pad 1.68)
  other vias: 21.7,54.8
N$51  (via drill 0.8 pad 1.68)
  other vias: 24.3,54.8
N$52  (via drill 0.8 pad 1.68)
  other vias: 29.9,47.2
N$53  (via drill 0.8 pad 1.68)
  other vias: 26.8,47.2
N$54  (via drill 0.8 pad 1.68)
  other vias: 24.3,47.2
N$55  (via drill 0.8 pad 1.68)
  other vias: 21.7,47.2
N$56  (via drill 0.8 pad 1.68)
  other vias: 19.2,47.2
N$57  (via drill 0.8 pad 1.68)
  other vias: 65.9,7.5
N$58  (via drill 0.8 pad 1.68)
  other vias: 65.9,2.5
N$59  (via drill 0.8 pad 1.68)
  other vias: 22.5,19
N$60  (via drill 0.8 pad 1.68)
  other vias: 25.6,19
N$61  (via drill 0.8 pad 1.68)
  other vias: 14.7,51
N$62  (via drill 0.8 pad 1.68)
  other vias: 77.2,11.6
N$63  (via drill 0.8 pad 1.68)
  other vias: 14.7,48.45
N$64  (via drill 0.8 pad 1.68)
  other vias: 14.7,53.55
N$65  (via drill 1 pad 2.18)
  other vias: 34.9,8.5
N$66  (via drill 1 pad 2.18)
  other vias: 24.7,2.3
N$67  (via drill 1 pad 2.18)
  other vias: 24.7,8.5
N$68  (via drill 1 pad 2.18)
  other vias: 24.7,11.5
N$69  (via drill 1 pad 2.18)
  other vias: 59.7,11.3
N$70  (via drill 1 pad 2.18)
  other vias: 64.8,15.55
N$71  (via drill 1 pad 2.18)
  other vias: 64.8,12
NEUTRAL  (via drill 1 pad 2.18)
  Bottom 1.27: 24VRMS.1 HEATER.2 21.61,18.11 21.95,18.45 | D2.C D4.A v24.7,5.5 23.3,5.5 22,6.8 22,18.4 21.95,18.45 | 21.95,18.45 R2.1
PGC
  Bottom 0.61: IC1.27 84.52,49.02 85.3,49.8 85.3,52.5 84.4,53.4 80.9,53.4 80.07,54.23 ICSP.2
PGD
  Bottom 0.61: IC1.28 79.64,51.56 77.53,53.67 ICSP.3
VGND
  Bottom 0.406: R10.2
  Bottom 0.61: IC4.6 IC4.7 24.27,45.93 24.6,45.6 36.6,45.6 46.9,35.2 58.1,35.2 R10.2 | IC1.4 72.76,43.94 71.3,45.4 65.4,45.4 63.7,43.7 63.7,39.2 62.29,37.79 R10.2
VPP
  Bottom 0.406: 69.75,51.56 R6.1
  Bottom 0.61: 69.75,51.56 IC1.1 ICSP.4
ZEROCROSSING
  Bottom 0.61: IC1.21 79.82,33.78 78.6,35 66,35 64.5,33.5 47.2,33.5 44.1,30.4 JMP2.2
ZEROCROSSING_B
  Bottom 0.406: 44.82,23.9 JMP2.1
  Bottom 0.61: 44.82,23.9 49.2,23.9 50.14,22.96 R3.1 50.1,21.17 50.1,20.2 49.5,19.6 39.8,19.6 | OPTO2.5 39.1,26.6 39.8,25.9 39.8,19.6 | 39.8,19.6 39.8,19.4 39.05,18.65 OPTO1.5

### Text on the board
Bottom: IronDriver | RevA | 10/2014 | Iuri C.